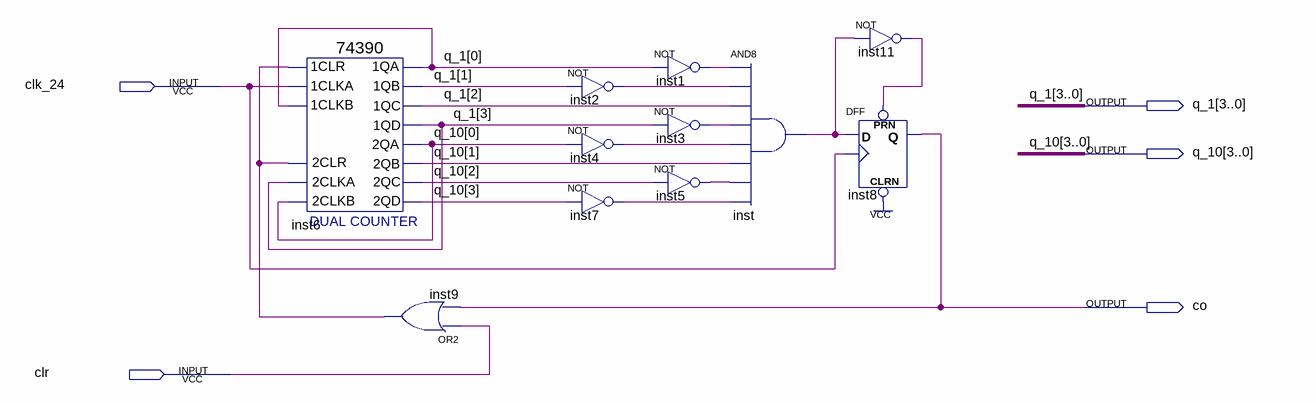
[diagram p0: schematic sheet]
// Quartus schematic cnt24.bdf as structural Verilog: 11 symbols, 5 pins
module cnt24 (
  input  clk_24,
  input  clr,
  output [3:0] q_1,
  output [3:0] q_10,
  output co
);

  wire inst1_out, inst2_out, inst3_out, inst4_out, inst5_out, inst7_out, inst9_out, inst11_out, inst_out;

  \74390  inst6 (
    .\2CLKA (q_1[3]), .\2CLR (inst9_out), .\2CLKB (q_10[0]), .\1CLR (inst9_out), .\1CLKA (clk_24),
    .\1CLKB (q_1[0]), .\1QA (q_1[0]), .\1QB (q_1[1]), .\1QC (q_1[2]), .\1QD (q_1[3]), .\2QA (q_10[0]),
    .\2QB (q_10[1]), .\2QC (q_10[2]), .\2QD (q_10[3]));
  or inst9 (inst9_out, clr, co);
  not inst2 (inst2_out, q_1[1]);
  not inst4 (inst4_out, q_10[0]);
  not inst7 (inst7_out, q_10[3]);
  not inst1 (inst1_out, q_1[0]);
  not inst3 (inst3_out, q_1[3]);
  not inst5 (inst5_out, q_10[2]);
  and inst (inst_out, inst1_out, inst2_out, q_1[2], inst3_out, inst4_out, q_10[1], inst5_out, inst7_out);
  DFF inst8 (.CLRN(1'b1), .CLK(clk_24), .D(inst_out), .PRN(inst11_out), .Q(co));
  not inst11 (inst11_out, inst_out);
endmodule
